# Altium project ECP5_V2.PrjPcb (part 2 of 2)

## Sheet [05] - FLASH.SchDoc
size A3
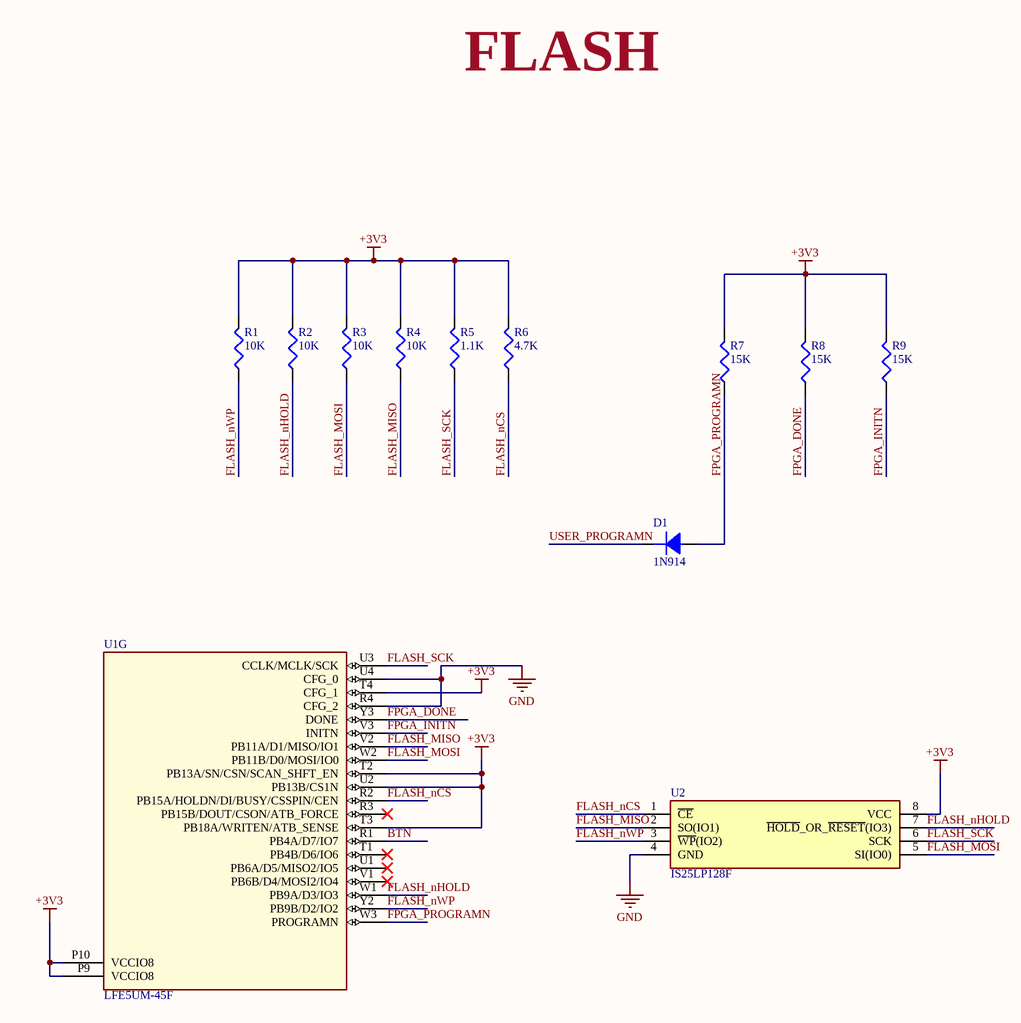
[diagram p4: [05] - FLASH.SchDoc]

### Parts
D1  1N914  [SOD323]
R1  10K  [R0603]
R2  10K  [R0603]
R3  10K  [R0603]
R4  10K  [R0603]
R5  1.1K  [R0603]
R6  4.7K  [R0603]
R7  15K  [R0603]
R8  15K  [R0603]
R9  15K  [R0603]
U1  LFE5UM-45F  [LFE5BG381]  (part G of 11)
U2  IS25LP128F  [SOIC127P790X216-8N]

### Nets
+3V3: R1.2 R2.2 R3.2 R4.2 R5.2 R6.2 R7.2 R8.2 R9.2 U1.P9(VCCIO8) U1.P10(VCCIO8) U1.T2(PB13A/SN/CSN/SCAN_SHFT_EN) U1.T3(PB18A/WRITEN/ATB_SENSE) U1.T4(CFG_1) U1.U2(PB13B/CS1N) U2.8(VCC)
GND: U1.R4(CFG_2) U1.U4(CFG_0) U2.4(GND)
BTN: U1.R1(PB4A/D7/IO7)
FLASH_MISO: R4.1 U1.V2(PB11A/D1/MISO/IO1) U2.2(SO(IO1))
FLASH_MOSI: R3.1 U1.W2(PB11B/D0/MOSI/IO0) U2.5(SI(IO0))
FLASH_nCS: R6.1 U1.R2(PB15A/HOLDN/DI/BUSY/CSSPIN/CEN) U2.1(~{CE})
FLASH_nHOLD: R2.1 U1.W1(PB9A/D3/IO3) U2.7(~{HOLD}_OR_~{RESET}(IO3))
FLASH_nWP: R1.1 U1.Y2(PB9B/D2/IO2) U2.3(~{WP}(IO2))
FLASH_SCK: R5.1 U1.U3(CCLK/MCLK/SCK) U2.6(SCK)
FPGA_DONE: R8.1 U1.Y3(DONE)
FPGA_INITN: R9.1 U1.V3(INITN)
FPGA_PROGRAMN: D1.2(Anode) R7.1 U1.W3(PROGRAMN)
USER_PROGRAMN: D1.1(Cathode)

Not connected (* = marked no-connect by the designer): U1 R3(PB15B/DOUT/CSON/ATB_FORCE)* T1(PB4B/D6/IO6)* U1(PB6A/D5/MISO2/IO5)* V1(PB6B/D4/MOSI2/IO4)*

### Notes on the sheet
- FLASH

### Library data of the parts
D1 = 1N914BWS: ON SEMICONDUCTOR/FAIRCHILD - 1N914BWS. - SMALL SIGNAL DIODE; Forward Current: 150mA; Peak Reverse Current: 5uA; Max Repetitive Reverse Voltage (Vrrm): 75V; Element Configuration: Single; Forward Voltage: 1V; Power Dissipation: 200mW; Reverse Recovery Time: 4ns; Max Forward Surge Current (Ifsm): 4A; Supplier 1: Digi-Key; Manufacturer: ON Semiconductor / Fairchild; Manufacturer Part Number: 1N914BWS; Stock 1: 133438; Pricing 1: 1=0.16, 10=0.147, 25=0.14, 100=0.0616, 250=0.05912, 500=0.04838, 1000=0.0336 (USD); Mount: Surface Mount; Number of Pins: 2; Weight: 0.0276g; Contact Plating: Tin,Matte; Min Operating Temperature: -55°C; Max Operating Temperature: 150°C; Packaging: Tape and Reel; Package Quantity: 1; Average Rectified Current: 150mA; Max Reverse Voltage (DC): 75V; Reverse Voltage: 75V; Recovery Time: 4ns; Length: 1.8mm; Height: 1mm; Width: 1.35mm; Radiation Hardening: No; Lead Free: Lead Free; REACH SVHC: No SVHC; ComponentLink1URL: https://www.fairchildsemi.com/datasheets/1N/1N4148WS.pdf?src-supplier=Digi-Key; ComponentLink1Description: https://www.fairchildsemi.com/datasheets/1N/1N4148WS.pdf?src-supplier=Digi-Key; ComponentLink2URL: https://www.onsemi.com/pub/Collateral/1N914BWS-D.pdf?src-supplier=Digi-Key; ComponentLink2Description: https://www.onsemi.com/pub/Collateral/1N914BWS-D.pdf?src-supplier=Digi-Key; ComponentLink3URL: http://www.fairchildsemi.com/ds/1N/1N914BWS.pdf?src-supplier=Future+Electronics; ComponentLink3Description: http://www.fairchildsemi.com/ds/1N/1N914BWS.pdf?src-supplier=Future+Electronics; ComponentLink4URL: http://www.farnell.com/datasheets/1771770.pdf?src-supplier=Element14; ComponentLink4Description: http://www.farnell.com/datasheets/1771770.pdf?src-supplier=Element14; ComponentLink5URL: https://www.fairchildsemi.com/datasheets/1N/1N914BWS.pdf?src-supplier=Avnet; ComponentLink5Description: https://www.fairchildsemi.com/datasheets/1N/1N914BWS.pdf?src-supplier=Avnet; ComponentLink6URL: http://www.fairchildsemi.com/ds/1N/1N914BWS.pdf?src-supplier=Avnet+Europe; ComponentLink6Description: http://www.fairchildsemi.com/ds/1N/1N914BWS.pdf?src-supplier=Avnet+Europe; Supplier Part Number 1: 1N914BWSDKR-ND
R1-R4 = RC0603FR-0710KL: Res General Purpose Thick Film 0603 10K Ohm 1% 1/10W ±100ppm/°C Molded SMD Paper T/R; Manufacturer: Yageo; Resistance: 10kR; Voltage Rating (DC): 50V; Power Rating: 100mW; Voltage Rating: 75V; Supplier 1: Digi-Key; Manufacturer Part Number: RC0603FR-0710KL; Stock 1: 1155; Pricing 1: 1=0.1, 10=0.023, 100=0.0094, 1000=0.00421, 2500=0.00366 (USD); Case/Package: 0603; Number of Pins: 2; Weight: 7.1E-05oz; Case Code (Imperial): 0603; Case Code (Metric): 1608; Min Operating Temperature: -55°C; Max Operating Temperature: 155°C; Tolerance: 1%; Composition: Thick Film; Temperature Coefficient: 100ppm/°C; Packaging: Tape and Reel; Military Standard: Not; Termination: SMD/SMT; Length: 1.6mm; Height: 0.45mm; Width: 0.8mm; Depth: 0.8mm; Lead Pitch: 0.3mm; REACH SVHC: No SVHC; Lead Free: Lead Free; ComponentLink1URL: http://www.farnell.com/datasheets/38590.pdf?src-supplier=Element14; ComponentLink1Description: http://www.farnell.com/datasheets/38590.pdf?src-supplier=Element14; ComponentLink2URL: https://www.verical.com/server-webapp/html/getDatasheet?partID=409289&src-supplier=Verical; ComponentLink2Description: https://www.verical.com/server-webapp/html/getDatasheet?partID=409289&src-supplier=Verical; ComponentLink3URL: http://www.farnell.com/datasheets/1868787.pdf?src-supplier=Element14; ComponentLink3Description: http://www.farnell.com/datasheets/1868787.pdf?src-supplier=Element14; ComponentLink4URL: http://www.farnell.com/datasheets/2167052.pdf?src-supplier=Element14; ComponentLink4Description: http://www.farnell.com/datasheets/2167052.pdf?src-supplier=Element14; ComponentLink5URL: http://www.farnell.com/datasheets/443971.pdf?src-supplier=Element14; ComponentLink5Description: http://www.farnell.com/datasheets/443971.pdf?src-supplier=Element14; Supplier Part Number 1: 311-10.0KHRDKR-ND
R5 = RC0603FR-071K1L: RES SMD 1.1K OHM 1% 1/10W 0603; Manufacturer: Yageo; Power Rating: 100mW; Temperature Coefficient: 100ppm/°C; Resistance: 1.1kR; Voltage Rating: 50V; Supplier 1: Digi-Key; Manufacturer Part Number: RC0603FR-071K1L; Stock 1: 534181; Pricing 1: 1=0.1, 10=0.023, 100=0.0094, 1000=0.00421, 2500=0.00366 (USD); Case/Package: 0603; Number of Pins: 2; Case Code (Metric): 1608; Case Code (Imperial): 0603; Min Operating Temperature: -55°C; Max Operating Temperature: 155°C; Tolerance: 1%; Package Quantity: 1; Packaging: Tape and Reel; Composition: Thick Film; Number of Terminations: 2; Termination: SMD/SMT; Military Standard: Not; Max Power Dissipation: 100mW; Voltage Rating (DC): 50V; Features: Moisture Resistant; Length: 1.6mm; Height: 0.022inch; Depth: 0.8mm; Width: 0.031inch; REACH SVHC: No SVHC; Lead Free: Lead Free; ComponentLink1URL: http://www.yageo.com/documents/recent/PYu-RC_Group_51_RoHS_L_10.pdf?src-supplier=Digi-Key; ComponentLink1Description: http://www.yageo.com/documents/recent/PYu-RC_Group_51_RoHS_L_10.pdf?src-supplier=Digi-Key; ComponentLink2URL: http://www.yageo.com/documents/recent/PYu-RC_Group_51_RoHS_L_9.pdf?src-supplier=Digi-Key; ComponentLink2Description: http://www.yageo.com/documents/recent/PYu-RC_Group_51_RoHS_L_9.pdf?src-supplier=Digi-Key; Supplier Part Number 1: 311-1.10KHRDKR-ND
R6 = RC0603FR-074K7L: RES SMD 4.7K OHM 1% 1/10W 0603; Manufacturer: Yageo; Resistance: 4.7kR; Temperature Coefficient: 100ppm/°C; Power Rating: 100mW; Voltage Rating (DC): 50V; Supplier 1: Digi-Key; Manufacturer Part Number: RC0603FR-074K7L; Stock 1: 1446473; Pricing 1: 1=0.1, 10=0.023, 100=0.0094, 1000=0.00421, 2500=0.00366 (USD); Case/Package: 0603; Number of Pins: 2; Case Code (Imperial): 0603; Case Code (Metric): 1608; Min Operating Temperature: -55°C; Max Operating Temperature: 155°C; Tolerance: 1%; Composition: Thick Film; Packaging: Tape and Reel; Voltage Rating: 50V; Termination: SMD/SMT; Military Standard: Not; Length: 1.6mm; Height: 0.45mm; Width: 0.8mm; Depth: 0.8mm; Lead Pitch: 0.3mm; REACH SVHC: No SVHC; Lead Free: Lead Free; ComponentLink1URL: https://www.verical.com/server-webapp/html/getDatasheet?partID=422754&src-supplier=Verical; ComponentLink1Description: https://www.verical.com/server-webapp/html/getDatasheet?partID=422754&src-supplier=Verical; ComponentLink2URL: http://www.farnell.com/datasheets/2167052.pdf?src-supplier=Element14; ComponentLink2Description: http://www.farnell.com/datasheets/2167052.pdf?src-supplier=Element14; ComponentLink3URL: http://www.farnell.com/datasheets/38590.pdf?src-supplier=Element14; ComponentLink3Description: http://www.farnell.com/datasheets/38590.pdf?src-supplier=Element14; ComponentLink4URL: http://www.farnell.com/datasheets/1868787.pdf?src-supplier=Element14; ComponentLink4Description: http://www.farnell.com/datasheets/1868787.pdf?src-supplier=Element14; Supplier Part Number 1: 311-4.70KHRCT-ND
R7-R9 = RC0603FR-0715KL: Res Thick Film 0603 15K Ohm 1% 1/10W ?100ppm/?C Molded SMD Paper T/R; Manufacturer: Yageo; Temperature Coefficient: 100ppm/°C; Resistance: 15kR; Power Rating: 100mW; Voltage Rating (DC): 50V; Supplier 1: Digi-Key; Manufacturer Part Number: RC0603FR-0715KL; Stock 1: 3342455; Pricing 1: 1=0.1, 10=0.023, 100=0.0094, 1000=0.00421, 2500=0.00366 (USD); Case/Package: 0603; Number of Pins: 2; Case Code (Metric): 1608; Case Code (Imperial): 0603; Min Operating Temperature: -55°C; Max Operating Temperature: 155°C; Tolerance: 1%; Composition: Thick Film; Packaging: Tape and Reel; Package Quantity: 1; Voltage Rating: 50V; Number of Terminations: 2; Termination: SMD/SMT; Military Standard: Not; Max Power Dissipation: 100mW; Features: Moisture Resistant; Length: 1.6mm; Height: 0.022inch; Width: 0.031inch; Depth: 0.8mm; Lead Free: Lead Free; REACH SVHC: Unknown; ComponentLink1URL: http://www.yageo.com/documents/recent/PYu-RC_Group_51_RoHS_L_10.pdf?src-supplier=Digi-Key; ComponentLink1Description: http://www.yageo.com/documents/recent/PYu-RC_Group_51_RoHS_L_10.pdf?src-supplier=Digi-Key; ComponentLink2URL: http://www.yageo.com/documents/recent/PYu-RC_Group_51_RoHS_L_9.pdf?src-supplier=Digi-Key; ComponentLink2Description: http://www.yageo.com/documents/recent/PYu-RC_Group_51_RoHS_L_9.pdf?src-supplier=Digi-Key; ComponentLink3URL: https://www.verical.com/server-webapp/html/getDatasheet?partID=327895&src-supplier=Verical; ComponentLink3Description: https://www.verical.com/server-webapp/html/getDatasheet?partID=327895&src-supplier=Verical; Supplier Part Number 1: 311-15.0KHRCT-ND
U1 = LFE5UM-45F-6BG381C: ECP5 Series 44 K LUTs 203 I/O 1.1 V Slow Surface Mount FPGA - CABGA-381; Manufacturer: Lattice Semiconductor; Number of Logic Blocks (LABs): 11000; Number of Logic Elements/Cells: 44000; RAM Size: 1990656b; Number of I/Os: 203; Supplier 1: Digi-Key; Manufacturer Part Number: LFE5UM-45F-6BG381C; Stock 1: 0; Pricing 1: 90=19.13967 (USD); Mount: Surface Mount; Case/Package: FBGA; Min Operating Temperature: 0°C; Max Operating Temperature: 85°C; Lead Free: Lead Free; ComponentLink1URL: http://www.latticesemi.com/~/media/LatticeSemi/Documents/DataSheets/ECP5/DS1044.pdf?src-supplier=Digi-Key; ComponentLink1Description: http://www.latticesemi.com/~/media/LatticeSemi/Documents/DataSheets/ECP5/DS1044.pdf?src-supplier=Digi-Key; Supplier Part Number 1: 220-1994-ND
U2 = IS25LP128F-JBLE: IC FLASH 128M SPI 133MHZ 8SOIC; Manufacturer: ISSI; Memory Type: Non-Volatile,FLASH; Memory Size: 128Mb; Supplier 1: Digi-Key; Manufacturer Part Number: IS25LP128F-JBLE; Stock 1: 0; Pricing 1: 540=1.7662 (USD); Mount: Surface Mount; Case/Package: SOIC; Min Operating Temperature: -40°C; Max Operating Temperature: 105°C; Frequency: 133MHz; ComponentLink1URL: http://www.farnell.com/datasheets/2625717.pdf?src-supplier=Farnell; ComponentLink1Description: http://www.farnell.com/datasheets/2625717.pdf?src-supplier=Farnell; ComponentLink2URL: http://www.farnell.com/datasheets/2625717.pdf?src-supplier=Newark; ComponentLink2Description: http://www.farnell.com/datasheets/2625717.pdf?src-supplier=Newark; ComponentLink3URL: http://www.issi.com/WW/pdf/25LP-WP128F.pdf?src-supplier=Digi-Key; ComponentLink3Description: http://www.issi.com/WW/pdf/25LP-WP128F.pdf?src-supplier=Digi-Key; Supplier Part Number 1: IS25LP128F-JBLE-ND

## Sheet [06] - GPIO.SchDoc
size A3
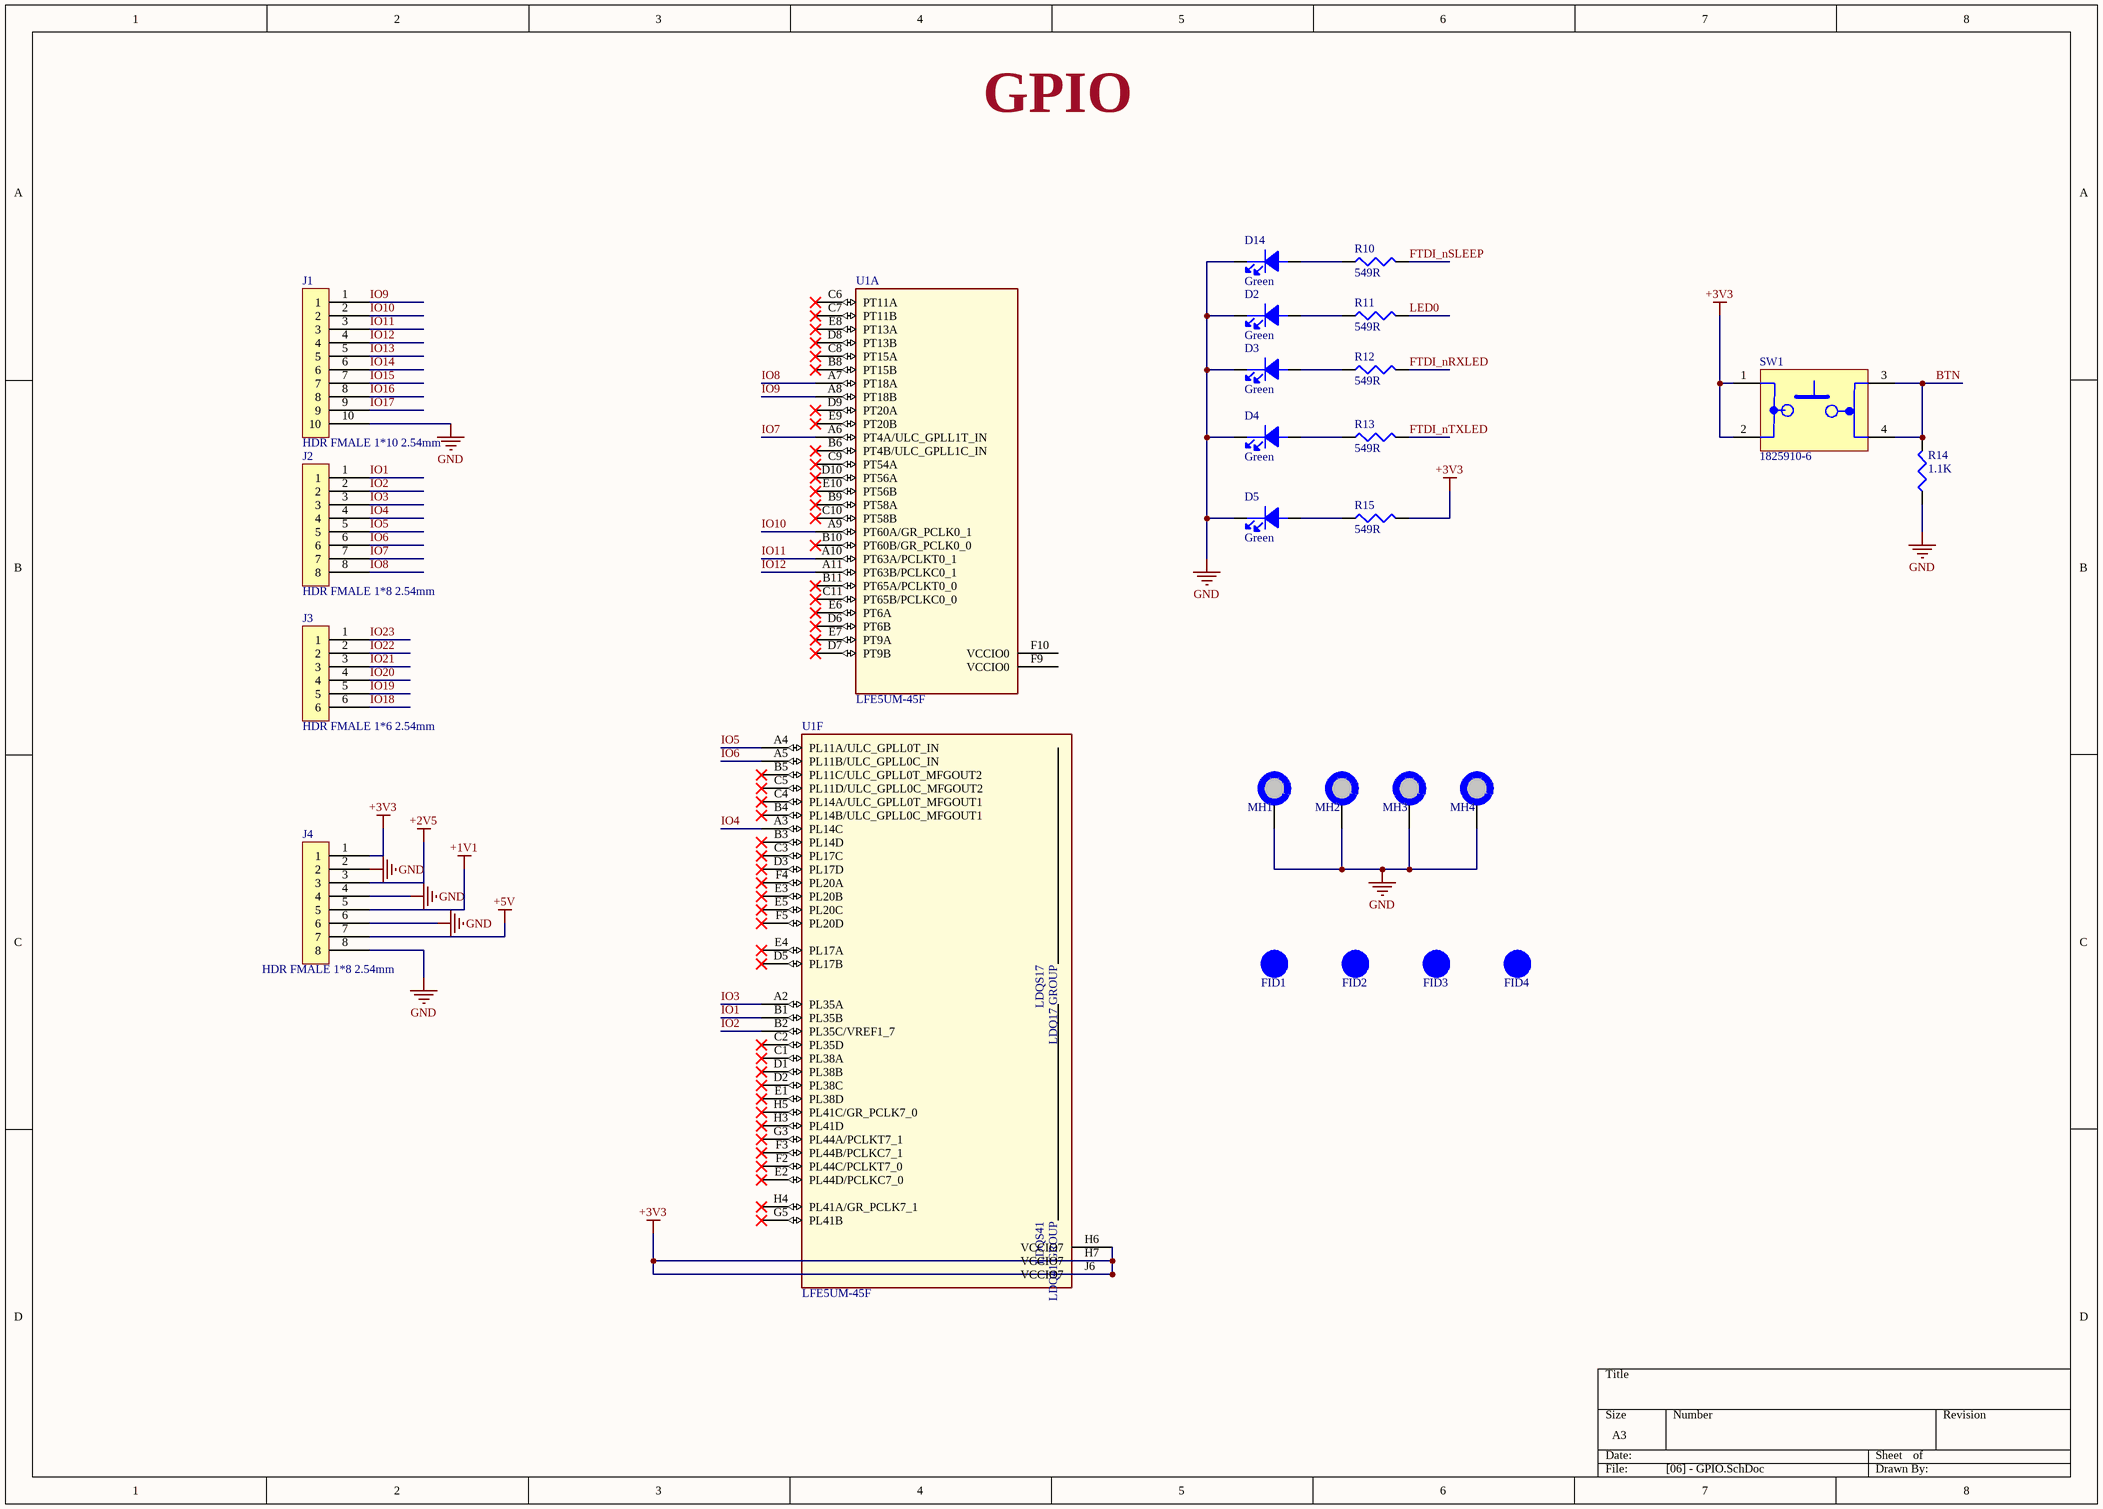
[diagram p5: [06] - GPIO.SchDoc]

### Parts
D2  Green  [LED_0603]
D3  Green  [LED_0603]
D4  Green  [LED_0603]
D5  Green  [LED_0603]
D14  Green  [LED_0603]
FID1  FID_1MMC  [FID_40x120D]  (value not drawn)  (no BOM)
FID2  FID_1MMC  [FID_40x120D]  (value not drawn)  (no BOM)
FID3  FID_1MMC  [FID_40x120D]  (value not drawn)  (no BOM)
FID4  FID_1MMC  [FID_40x120D]  (value not drawn)  (no BOM)
J1  HDR FMALE 1*10 2.54mm  [Hdr_Female_1*10_2.54mm]
J2  HDR FMALE 1*8 2.54mm  [Hdr_Female_1*8_2.54mm]
J3  HDR FMALE 1*6 2.54mm  [Hdr_Female_1*6_2.54mm]
J4  HDR FMALE 1*8 2.54mm  [Hdr_Female_1*8_2.54mm]
MH1  MH_7.4MMC_3.2MMD  [MH_7.4MMC_3.2MMD]  (value not drawn)  (no BOM)
MH2  MH_7.4MMC_3.2MMD  [MH_7.4MMC_3.2MMD]  (value not drawn)  (no BOM)
MH3  MH_7.4MMC_3.2MMD  [MH_7.4MMC_3.2MMD]  (value not drawn)  (no BOM)
MH4  MH_7.4MMC_3.2MMD  [MH_7.4MMC_3.2MMD]  (value not drawn)  (no BOM)
R10  549R  [R0603]
R11  549R  [R0603]
R12  549R  [R0603]
R13  549R  [R0603]
R14  1.1K  [R0603]
R15  549R  [R0603]
SW1  1825910-6  [1825910-6]
U1  LFE5UM-45F  [LFE5BG381]  (parts A,F of 11)

### Nets
+1V1: J4.5
+2V5: J4.3
+3V3: J4.1 R15.2 SW1.1 SW1.2 U1.H6(VCCIO7) U1.H7(VCCIO7) U1.J6(VCCIO7)
+5V: J4.7
GND: D2.1(Cathode) D3.1(Cathode) D4.1(Cathode) D5.1(Cathode) D14.1(Cathode) J1.10 J4.2 J4.4 J4.6 J4.8 MH1.1 MH2.1 MH3.1 MH4.1 R14.1
BTN: R14.2 SW1.3 SW1.4
FTDI_nRXLED: R12.2
FTDI_nSLEEP: R10.2
FTDI_nTXLED: R13.2
IO1: J2.1 U1.B1(PL35B)
IO2: J2.2 U1.B2(PL35C/VREF1_7)
IO3: J2.3 U1.A2(PL35A)
IO4: J2.4 U1.A3(PL14C)
IO5: J2.5 U1.A4(PL11A/ULC_GPLL0T_IN)
IO6: J2.6 U1.A5(PL11B/ULC_GPLL0C_IN)
IO7: J2.7 U1.A6(PT4A/ULC_GPLL1T_IN)
IO8: J2.8 U1.A7(PT18A)
IO9: J1.1 U1.A8(PT18B)
IO10: J1.2 U1.A9(PT60A/GR_PCLK0_1)
IO11: J1.3 U1.A10(PT63A/PCLKT0_1)
IO12: J1.4 U1.A11(PT63B/PCLKC0_1)
IO13: J1.5
IO14: J1.6
IO15: J1.7
IO16: J1.8
IO17: J1.9
IO18: J3.6
IO19: J3.5
IO20: J3.4
IO21: J3.3
IO22: J3.2
IO23: J3.1
LED0: R11.2
NetD2_2: D2.2(Anode) R11.1
NetD3_2: D3.2(Anode) R12.1
NetD4_2: D4.2(Anode) R13.1
NetD5_2: D5.2(Anode) R15.1
NetD14_2: D14.2(Anode) R10.1

Not connected (* = marked no-connect by the designer): U1 B3(PL14D)* B4(PL14B/ULC_GPLL0C_MFGOUT1)* B5(PL11C/ULC_GPLL0T_MFGOUT2)* B6(PT4B/ULC_GPLL1C_IN)* B8(PT15B)* B9(PT58A)* B10(PT60B/GR_PCLK0_0)* B11(PT65A/PCLKT0_0)* C1(PL38A)* C2(PL35D)* C3(PL17C)* C4(PL14A/ULC_GPLL0T_MFGOUT1)* C5(PL11D/ULC_GPLL0C_MFGOUT2)* C6(PT11A)* C7(PT11B)* C8(PT15A)* C9(PT54A)* C10(PT58B)* C11(PT65B/PCLKC0_0)* D1(PL38B)* D2(PL38C)* D3(PL17D)* D5(PL17B)* D6(PT6B)* D7(PT9B)* D8(PT13B)* D9(PT20A)* D10(PT56A)* E1(PL38D)* E2(PL44D/PCLKC7_0)* E3(PL20B)* E4(PL17A)* E5(PL20C)* E6(PT6A)* E7(PT9A)* E8(PT13A)* E9(PT20B)* E10(PT56B)* F2(PL44C/PCLKT7_0)* F3(PL44B/PCLKC7_1)* F4(PL20A)* F5(PL20D)* F9(VCCIO0) F10(VCCIO0) G3(PL44A/PCLKT7_1)* G5(PL41B)* H3(PL41D)* H4(PL41A/GR_PCLK7_1)* H5(PL41C/GR_PCLK7_0)*

### Notes on the sheet
- GPIO
- (in symbol LFE5UM-45F-6BG381C, part F) LDQS17; LDQ17 GROUP; LDQS41; LDQ41 GROUP

### Library data of the parts
D2-D5 D14 = LGL29K-G2J1-24-Z: LED Uni-Color Green 572nm 2-Pin Chip 0603(1608Metric) T/R; Manufacturer: Osram Opto; Lens Color: White; Forward Current: 20mA; Forward Voltage: 2.2V; Luminous Intensity: 5.6mcd; Viewing Angle: 160°; Lens Style: Flat,Diffused,Colorless,Rectangular; Test Current: 2mA; Dominant Wavelength: 570nm; Luminous Flux: 0.012lm; Number of LEDs: 1; Lens Transparency: Diffused; Reverse Voltage: 12V; Lens Size: 0.8mm; Supplier 1: Digi-Key; Manufacturer Part Number: LGL29K-G2J1-24-Z; Stock 1: 159662; Pricing 1: 1=0.5, 10=0.363, 100=0.2373, 500=0.17054, 1000=0.13347, 2500=0.12235 (USD); Mount: Surface Mount; Case/Package: 0603; Number of Pins: 2; Color: Green; Case Code (Metric): 1608; Case Code (Imperial): 0603; Min Operating Temperature: -40°C; Max Operating Temperature: 100°C; Illumination Color: Green; Packaging: Tape and Reel; Package Quantity: 5000; Number of Elements: 1; Length: 1.3mm; Height: 0.65mm; Width: 0.8mm; Depth: 0.8mm; Radiation Hardening: No; ComponentLink1URL: http://www.mouser.com/ds/2/311/LG%20L29K%20-%20SMARTLED%200603-335234.pdf?src-supplier=Mouser; ComponentLink1Description: http://www.mouser.com/ds/2/311/LG%20L29K%20-%20SMARTLED%200603-335234.pdf?src-supplier=Mouser; ComponentLink2URL: https://dammedia.osram.info/media/resource/hires/osram-dam-2493945/LG%20L29K.pdf?src-supplier=Digi-Key; ComponentLink2Description: https://dammedia.osram.info/media/resource/hires/osram-dam-2493945/LG%20L29K.pdf?src-supplier=Digi-Key; ComponentLink3URL: https://www.verical.com/server-webapp/html/getDatasheet?partID=571127&src-supplier=Verical; ComponentLink3Description: https://www.verical.com/server-webapp/html/getDatasheet?partID=571127&src-supplier=Verical; Supplier Part Number 1: 475-2709-6-ND
FID1-FID4 = FID_1MMC: Fiducial 40mil Diameter 120mil Mask
J1 = M20-7821046: 10-WAY SIL VERT SOCKET L/FREE; Manufacturer: Harwin; Number of Contacts: 10; Max Current Rating: 3A; Contact Resistance: 20mR; Mating Cycles: 50; Connector Type: Receptacle,Socket; Gender: Receptacle; Insulation Resistance: 1MR; Hole Diameter: 0.8mm; Supplier 1: Digi-Key; Manufacturer Part Number: M20-7821046; Stock 1: 415; Pricing 1: 1=1.28, 22=1.12182, 110=0.968, 506=0.792, 1012=0.704, 5016=0.616, 10010=0.5852 (USD); Mount: Through Hole; Case/Package: SIL; Color: Black; Contact Plating: Tin; Contact Material: Bronze; Housing Color: Black; Housing Material: Polyamide; Min Operating Temperature: -40°C; Max Operating Temperature: 105°C; Number of Rows: 1; Termination: Solder; Packaging: Rail/Tube; Contact Gender: Female; Package Quantity: 23; Current Rating: 3A; Number of Positions: 10; Orientation: Straight; Length: 25.8mm; Pitch: 2.54mm; Lead Pitch: 2.54mm; Depth: 2.5mm; Radiation Hardening: No; REACH SVHC: No SVHC; ComponentLink1URL: https://www.verical.com/server-webapp/html/getDatasheet?partID=559226&src-supplier=Verical; ComponentLink1Description: https://www.verical.com/server-webapp/html/getDatasheet?partID=559226&src-supplier=Verical; ComponentLink2URL: https://cdn.harwin.com/pdfs/M20-782.pdf?src-supplier=Digi-Key; ComponentLink2Description: https://cdn.harwin.com/pdfs/M20-782.pdf?src-supplier=Digi-Key; ComponentLink3URL: http://www.harwin.com/include/downloads/drawings/M20-782.PDF?src-supplier=Avnet; ComponentLink3Description: http://www.harwin.com/include/downloads/drawings/M20-782.PDF?src-supplier=Avnet; ComponentLink4URL: https://cdn.harwin.com/pdfs/Harwin_PC_Connectors_M20.pdf?src-supplier=Avnet+Europe; ComponentLink4Description: https://cdn.harwin.com/pdfs/Harwin_PC_Connectors_M20.pdf?src-supplier=Avnet+Europe; ComponentLink5URL: http://uk.rs-online.com/webdocs/1422/0900766b81422659.pdf?src-supplier=RSComponents; ComponentLink5Description: http://uk.rs-online.com/webdocs/1422/0900766b81422659.pdf?src-supplier=RSComponents; Supplier Part Number 1: 952-1847-ND
J2 J4 = M20-7820842: 08-WAY SIL VERT SOCKET L/FREE; Manufacturer: Harwin; Number of Contacts: 8; Max Current Rating: 3A; Contact Resistance: 20mR; Connector Type: Receptacle,Socket; Gender: Female; Supplier 1: Digi-Key; Manufacturer Part Number: M20-7820842; Stock 1: 4198; Pricing 1: 1=1.1, 27=0.91444, 108=0.83824, 513=0.68581, 1026=0.6096, 5022=0.5334, 10017=0.50673 (USD); Mount: Through Hole; Case/Package: SIL; Weight: 0.025397oz; Contact Plating: Tin,Gold; Color: Black; Contact Material: Bronze; Housing Color: Black; Housing Material: Polyamide; Min Operating Temperature: -40°C; Max Operating Temperature: 105°C; Number of Rows: 1; Termination: Solder; Contact Gender: Female; Package Quantity: 29; Packaging: Rail/Tube; Number of Positions: 8; Orientation: Straight; Length: 20.72mm; Pitch: 2.54mm; Depth: 2.5mm; Radiation Hardening: No; ComponentLink1URL: https://cdn.harwin.com/pdfs/Harwin_PC_Connectors_M20.pdf?src-supplier=Avnet+Europe; ComponentLink1Description: https://cdn.harwin.com/pdfs/Harwin_PC_Connectors_M20.pdf?src-supplier=Avnet+Europe; ComponentLink2URL: http://www.harwin.com/include/downloads/drawings/M20-782.PDF?src-supplier=Avnet; ComponentLink2Description: http://www.harwin.com/include/downloads/drawings/M20-782.PDF?src-supplier=Avnet; Supplier Part Number 1: 952-1823-ND
J3 = M20-7820646: 06-WAY SIL VERT SOCKET L/FREE; Manufacturer: Harwin; Number of Contacts: 6; Max Current Rating: 3A; Contact Resistance: 20mR; Connector Type: Receptacle,Socket; Gender: Female; Supplier 1: Digi-Key; Manufacturer Part Number: M20-7820646; Stock 1: 2187; Pricing 1: 1=0.96, 36=0.79194, 108=0.72602, 504=0.59401, 1008=0.528, 5004=0.462, 10008=0.4389 (USD); Mount: Through Hole; Case/Package: SIL; Color: Black; Contact Plating: Tin; Contact Material: Bronze; Housing Color: Black; Housing Material: Nylon; Min Operating Temperature: -40°C; Max Operating Temperature: 105°C; Number of Rows: 1; Termination: Solder; Packaging: Rail/Tube; Contact Gender: Female; Package Quantity: 38; Number of Positions: 6; Orientation: Straight; Length: 15.64mm; Pitch: 2.54mm; Depth: 2.5mm; Radiation Hardening: No; Supplier Part Number 1: 952-1809-ND
MH1-MH4 = MH_7.4MMC_3.2MMD: Mounting Hole 7..4mm Diameter_3.2mm Drill
R10-R13 R15 = RC0603FR-07549RL: RES SMD 549 OHM 1% 1/10W 0603; Manufacturer: Yageo; Power Rating: 100mW; Voltage Rating: 50V; Temperature Coefficient: 100ppm/°C; Supplier 1: Digi-Key; Manufacturer Part Number: RC0603FR-07549RL; Stock 1: 134588; Pricing 1: 1=0.1, 10=0.023, 100=0.0094, 1000=0.00421, 2500=0.00366 (USD); Case/Package: 0603; Case Code (Metric): 1608; Case Code (Imperial): 0603; Min Operating Temperature: -55°C; Max Operating Temperature: 155°C; Package Quantity: 1; Resistance: 549R; Tolerance: 1%; Packaging: Tape and Reel; Composition: Thick Film; Number of Terminations: 2; Termination: SMD/SMT; Military Standard: Not; Max Power Dissipation: 100mW; Voltage Rating (DC): 50V; Features: Moisture Resistant; Length: 1.6mm; Height: 0.022inch; Width: 0.031inch; Depth: 0.8mm; Lead Free: Lead Free; ComponentLink1URL: http://www.yageo.com/documents/recent/PYu-RC_Group_51_RoHS_L_10.pdf?src-supplier=Digi-Key; ComponentLink1Description: http://www.yageo.com/documents/recent/PYu-RC_Group_51_RoHS_L_10.pdf?src-supplier=Digi-Key; ComponentLink2URL: http://www.yageo.com/documents/recent/PYu-RC_Group_51_RoHS_L_9.pdf?src-supplier=Digi-Key; ComponentLink2Description: http://www.yageo.com/documents/recent/PYu-RC_Group_51_RoHS_L_9.pdf?src-supplier=Digi-Key; Supplier Part Number 1: 311-549HRDKR-ND
R14 = RC0603FR-071K1L: as R5 on sheet [05] - FLASH; Supplier 1: Digi-Key; Manufacturer Part Number: RC0603FR-071K1L; Stock 1: 534181; Pricing 1: 1=0.1, 10=0.023, 100=0.0094, 1000=0.00421, 2500=0.00366 (USD); Case/Package: 0603; Number of Pins: 2; Case Code (Metric): 1608; Case Code (Imperial): 0603; Min Operating Temperature: -55°C; Max Operating Temperature: 155°C; Tolerance: 1%; Package Quantity: 1; Packaging: Tape and Reel; Composition: Thick Film; Number of Terminations: 2; Termination: SMD/SMT; Military Standard: Not; Max Power Dissipation: 100mW; Voltage Rating (DC): 50V; Features: Moisture Resistant; Length: 1.6mm; Height: 0.022inch; Depth: 0.8mm; Width: 0.031inch; REACH SVHC: No SVHC; Lead Free: Lead Free; ComponentLink1URL: http://www.yageo.com/documents/recent/PYu-RC_Group_51_RoHS_L_10.pdf?src-supplier=Digi-Key; ComponentLink1Description: http://www.yageo.com/documents/recent/PYu-RC_Group_51_RoHS_L_10.pdf?src-supplier=Digi-Key; ComponentLink2URL: http://www.yageo.com/documents/recent/PYu-RC_Group_51_RoHS_L_9.pdf?src-supplier=Digi-Key; ComponentLink2Description: http://www.yageo.com/documents/recent/PYu-RC_Group_51_RoHS_L_9.pdf?src-supplier=Digi-Key; Supplier Part Number 1: 311-1.10KHRDKR-ND
SW1 = 1825910-6: ALCOSWITCH - TE CONNECTIVITY - 1825910-6 - TACT SWITCH, SPST, 0.05A, 24VDC, SOLDER; Manufacturer: TE Connectivity Alcoswitch; Actuator Material: PBT; Mechanical Life: 100000Cycles; Operating Force: 160gf; Illumination Type: Non-Illuminated,Illuminated; Switch Travel: 0.25mm; Switch Function: Off-Mom; Actuator Type: Standard; Max Voltage Rating (DC): 24V; Contact Current Rating: 50mA; Contact Resistance: 100mR; Actuator Length: 0.055inch; Supplier 1: Digi-Key; Manufacturer Part Number: 1825910-6; Stock 1: 40831; Pricing 1: 1=0.1, 10=0.101, 25=0.0976, 50=0.094, 100=0.0888, 250=0.08352, 500=0.08006, 1000=0.06091, 5000=0.05047 (USD); Mount: Through Hole; Contact Material: Copper Alloy; Contact Plating: Silver; Min Operating Temperature: -35°C; Max Operating Temperature: 85°C; Termination: PC Pins; Throw Configuration: SPST; Package Quantity: 750; Packaging: Loose Piece; Orientation: Straight; Electrical Life: 100000Cycles; Type: Switch; Max Current Rating: 50mA; Length: 5.99mm; REACH SVHC: Unknown; ELV: Compliant; Lead Free: Lead Free; ComponentLink1URL: http://www.onlinecomponents.com/productFiles/mf-AMP/1825910-6rqpn1825910-6.pdf?src-supplier=Onlinecomponents.com; ComponentLink1Description: http://www.onlinecomponents.com/productFiles/mf-AMP/1825910-6rqpn1825910-6.pdf?src-supplier=Onlinecomponents.com; ComponentLink2URL: http://www.te.com/commerce/DocumentDelivery/DDEController?Action=srchrtrv&DocNm=1825910&DocType=Customer+Drawing&DocLang=English&src-supplier=Verical; ComponentLink2Description: http://www.te.com/commerce/DocumentDelivery/DDEController?Action=srchrtrv&DocNm=1825910&DocType=Customer+Drawing&DocLang=English&src-supplier=Verical; Supplier Part Number 1: 450-1650-ND
U1 = LFE5UM-45F-6BG381C: as U1 on sheet [05] - FLASH; Supplier 1: Digi-Key; Manufacturer Part Number: LFE5UM-45F-6BG381C; Stock 1: 0; Pricing 1: 90=19.13967 (USD); Mount: Surface Mount; Case/Package: FBGA; Min Operating Temperature: 0°C; Max Operating Temperature: 85°C; Lead Free: Lead Free; ComponentLink1URL: http://www.latticesemi.com/~/media/LatticeSemi/Documents/DataSheets/ECP5/DS1044.pdf?src-supplier=Digi-Key; ComponentLink1Description: http://www.latticesemi.com/~/media/LatticeSemi/Documents/DataSheets/ECP5/DS1044.pdf?src-supplier=Digi-Key; Supplier Part Number 1: 220-1994-ND

## Sheet [07] - UNUSED.SchDoc
size A3
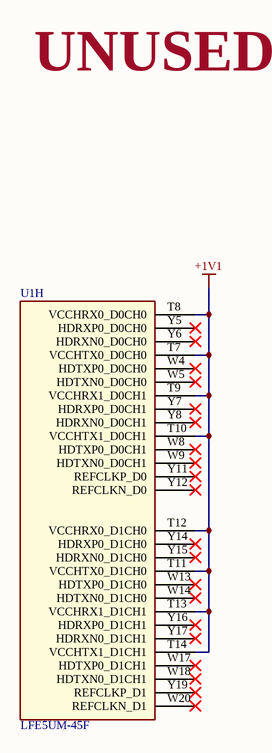
[diagram p6: [07] - UNUSED.SchDoc]

### Parts
U1  LFE5UM-45F  [LFE5BG381]  (part H of 11)

### Nets
+1V1: U1.T7(VCCHTX0_D0CH0) U1.T8(VCCHRX0_D0CH0) U1.T9(VCCHRX1_D0CH1) U1.T10(VCCHTX1_D0CH1) U1.T11(VCCHTX0_D1CH0) U1.T12(VCCHRX0_D1CH0) U1.T13(VCCHRX1_D1CH1) U1.T14(VCCHTX1_D1CH1)

Not connected (* = marked no-connect by the designer): U1 W4(HDTXP0_D0CH0)* W5(HDTXN0_D0CH0)* W8(HDTXP0_D0CH1)* W9(HDTXN0_D0CH1)* W13(HDTXP0_D1CH0)* W14(HDTXN0_D1CH0)* W17(HDTXP0_D1CH1)* W18(HDTXN0_D1CH1)* W20(REFCLKN_D1)* Y5(HDRXP0_D0CH0)* Y6(HDRXN0_D0CH0)* Y7(HDRXP0_D0CH1)* Y8(HDRXN0_D0CH1)* Y11(REFCLKP_D0)* Y12(REFCLKN_D0)* Y14(HDRXP0_D1CH0)* Y15(HDRXN0_D1CH0)* Y16(HDRXP0_D1CH1)* Y17(HDRXN0_D1CH1)* Y19(REFCLKP_D1)*

### Notes on the sheet
- UNUSED

### Library data of the parts
U1 = LFE5UM-45F-6BG381C: as U1 on sheet [05] - FLASH; Supplier 1: Digi-Key; Manufacturer Part Number: LFE5UM-45F-6BG381C; Stock 1: 0; Pricing 1: 90=19.13967 (USD); Mount: Surface Mount; Case/Package: FBGA; Min Operating Temperature: 0°C; Max Operating Temperature: 85°C; Lead Free: Lead Free; ComponentLink1URL: http://www.latticesemi.com/~/media/LatticeSemi/Documents/DataSheets/ECP5/DS1044.pdf?src-supplier=Digi-Key; ComponentLink1Description: http://www.latticesemi.com/~/media/LatticeSemi/Documents/DataSheets/ECP5/DS1044.pdf?src-supplier=Digi-Key; Supplier Part Number 1: 220-1994-ND

## Nets that join several sheets
+1V1: [01] - POWER (33 pins), [06] - GPIO (J4.5), [07] - UNUSED (8 pins)
+2V5: [01] - POWER (17 pins), [06] - GPIO (J4.3)
+3V3: [01] - POWER (12 pins), [02] - USB (6 pins), [03] - SDCARD (J5.4), [04] - RAM (13 pins), [05] - FLASH (16 pins), [06] - GPIO (7 pins)
+5V: [01] - POWER (9 pins), [02] - USB (D6.1 J7.1), [06] - GPIO (J4.7)
GND: [01] - POWER (112 pins), [02] - USB (21 pins), [03] - SDCARD (7 pins), [04] - RAM (7 pins), [05] - FLASH (U1.R4 U1.U4 U2.4), [06] - GPIO (15 pins)
BTN: [05] - FLASH (U1.R1), [06] - GPIO (R14.2 SW1.3 SW1.4)
FTDI_nRXLED: [02] - USB (U1.L5 U7.17), [06] - GPIO (R12.2)
FTDI_nSLEEP: [02] - USB (U7.19), [06] - GPIO (R10.2)
FTDI_nTXLED: [02] - USB (U7.10), [06] - GPIO (R13.2)
IO13: [02] - USB (U1.A12), [06] - GPIO (J1.5)
IO14: [02] - USB (U1.A13), [06] - GPIO (J1.6)
IO15: [02] - USB (U1.A14), [06] - GPIO (J1.7)
IO16: [02] - USB (U1.A15), [06] - GPIO (J1.8)
IO17: [02] - USB (U1.A16), [06] - GPIO (J1.9)
IO18: [02] - USB (U1.P4), [06] - GPIO (J3.6)
IO19: [02] - USB (U1.P3), [06] - GPIO (J3.5)
IO20: [02] - USB (U1.P2), [06] - GPIO (J3.4)
IO21: [02] - USB (U1.P1), [06] - GPIO (J3.3)
IO22: [02] - USB (U1.L1), [06] - GPIO (J3.2)
IO23: [02] - USB (U1.K3), [06] - GPIO (J3.1)
LED0: [02] - USB (U1.A18), [06] - GPIO (R11.2)
SD_CLK: [02] - USB (U1.H2), [03] - SDCARD (J5.5)
SD_CMD: [02] - USB (U1.J1), [03] - SDCARD (J5.3)
SD_D0: [02] - USB (U1.J3), [03] - SDCARD (J5.7)
SD_D1: [02] - USB (U1.H1), [03] - SDCARD (J5.8)
SD_D2: [02] - USB (U1.K1), [03] - SDCARD (J5.1)
SD_D3: [02] - USB (U1.K2), [03] - SDCARD (J5.2)
USB_FPGA_D+: [02] - USB (5 pins), [04] - RAM (U1.E16)
USB_FPGA_D-: [02] - USB (5 pins), [04] - RAM (U1.F16)
USER_PROGRAMN: [02] - USB (U1.M4), [05] - FLASH (D1.1)